# EAGLE design TutorialPCB (EAGLE 8.7.0)
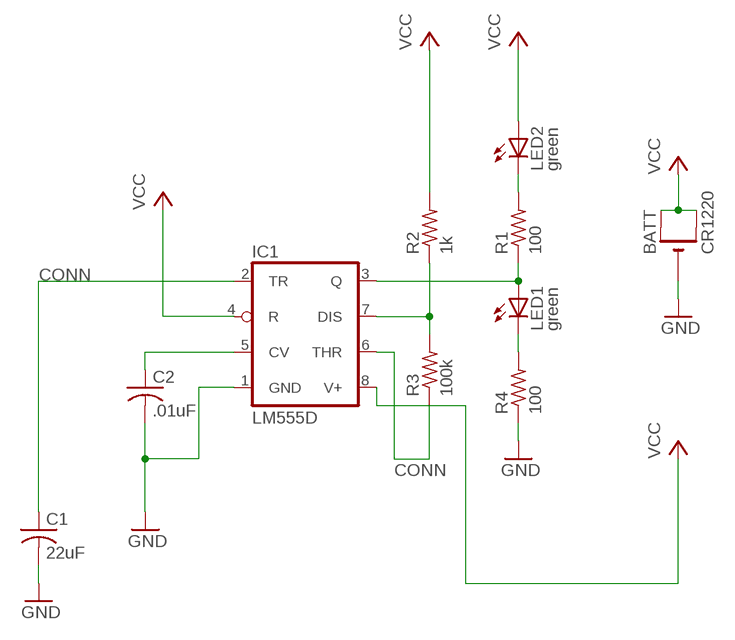
[diagram p0: schematic, sheet 1]

## Parts
BATT  CR1220  CR1220SMT  [CR1220-SMD]
C1  22uF  C-USC0805  [C0805]
C2  .01uF  C-USC0805  [C0805]
IC1  LM555D  [SO08]
LED1  green  LEDCHIPLED_0805  [CHIPLED_0805]
LED2  green  LEDCHIPLED_0805  [CHIPLED_0805]
R1  100  R-US_R0805  [R0805]
R2  1k  R-US_R0805  [R0805]
R3  100k  R-US_R0805  [R0805]
R4  100  R-US_R0805  [R0805]

## Nets
CONN: C1.1 IC1.2(TR) IC1.6(THR) R3.1
GND: BATT.- C1.2 C2.2 IC1.1(GND) R4.1
N$1: LED1.C R4.2
N$2: IC1.3(Q) LED1.A R1.1
N$3: LED2.C R1.2
N$4: IC1.7(DIS) R2.1 R3.2
N$9: C2.1 IC1.5(CV)
VCC: BATT.+$1(+) BATT.+$2(+1) IC1.4(R) IC1.8(V+) LED2.A R2.2

## Library data of the parts
BATT = adafruit:CR1220: CR1216/CR1220/CR1225 12mm 3V lithium coin cell Great for battery packup. Both SMT and THM holders. Note the THM package has the ground pads on both sides of the PCB so that the masks are the same - this reduces the cost
C1 C2 = adafruit:C-US: CAPACITOR, American symbol
IC1 = adafruit:*555: TIMER Changed DIP package to have round (not oval) pin pads http://www.ladyada.net/library/pcb/eaglelibrary.html
LED1 LED2 = adafruit:LED: LED OSRAM: - CHIPLED LG R971, LG N971, LY N971, LG Q971, LY Q971, LO R971, LY R971 LH N974, LH R974 LS Q976, LO Q976, LY Q976 LO Q996 - Hyper CHIPLED LW Q18S LB Q993, LB Q99A, LB R99A - SideLED LS A670, LO A670, LY A670, LG A670, LP A670 LB A673, LV A673, LT A673, LW A673 LH A674 LY A675 LS A676, LA A676, LO A676, LY A676, LW A676 LS A679, LY A679, LG A679 - Hyper Micro SIDELED® LS Y876, LA Y876, LO Y876, LY Y876 LT Y87S - SmartLED LW L88C, LW L88S LB L89C, LB L89S, LG L890 LS L89K, LO L89K, LY L89K LS L896, LA L896, LO L896, LY L896 - TOPLED LS T670, LO T670, LY T670, LG T670, LP T670 LSG T670, LSP T670, LSY T670, LOP T670, LYG T670 LG T671, LOG T671, LSG T671 LB T673, LV T673, LT T673, LW T673 LH T674 LS T676, LA T676, LO T676, LY T676, LB T676, LH T676, LSB T676, LW T676 LB T67C, LV T67C, LT T67C, LS T67K, LO T67K, LY T67K, LW E67C LS E67B, LA E67B, LO E67B, LY E67B, LB E67C, LV E67C, LT E67C LW T67C LS T679, LY T679, LG T679 LS T770, LO T770, LY T770, LG T770, LP T770 LB T773, LV T773, LT T773, LW T773 LH T774 LS E675, LA E675, LY E675, LS T675 LS T776, LA T776, LO T776, LY T776, LB T776 LHGB T686 LT T68C, LB T68C - Hyper Mini TOPLED® LB M676 - Mini TOPLED Santana® LG M470 LS M47K, LO M47K, LY M47K Source: http://www.osram.convergy.de/
R1-R4 = adafruit:R-US_: RESISTOR, American symbol

## Net classes
0 default: width 0.305 mm, drill 0.508 mm, clearance 0.254 mm

## Board
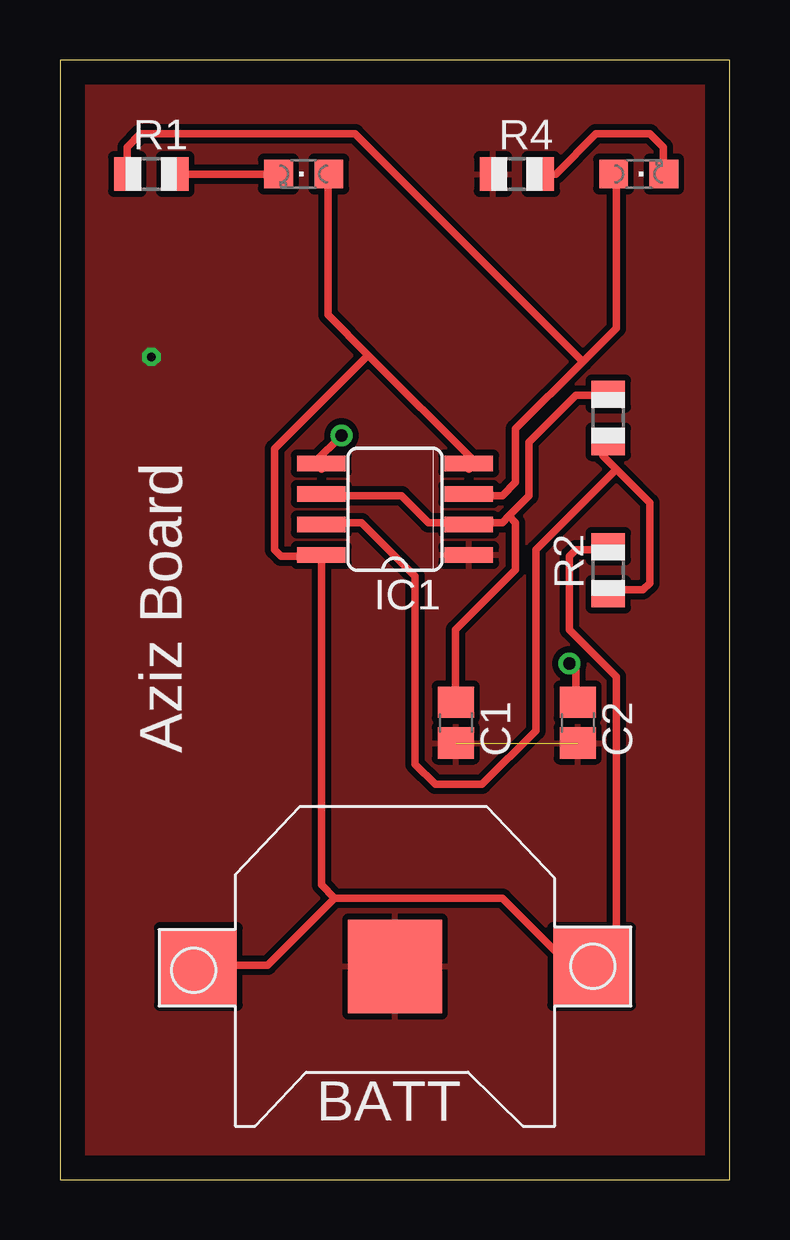
[diagram p1: board, top side]
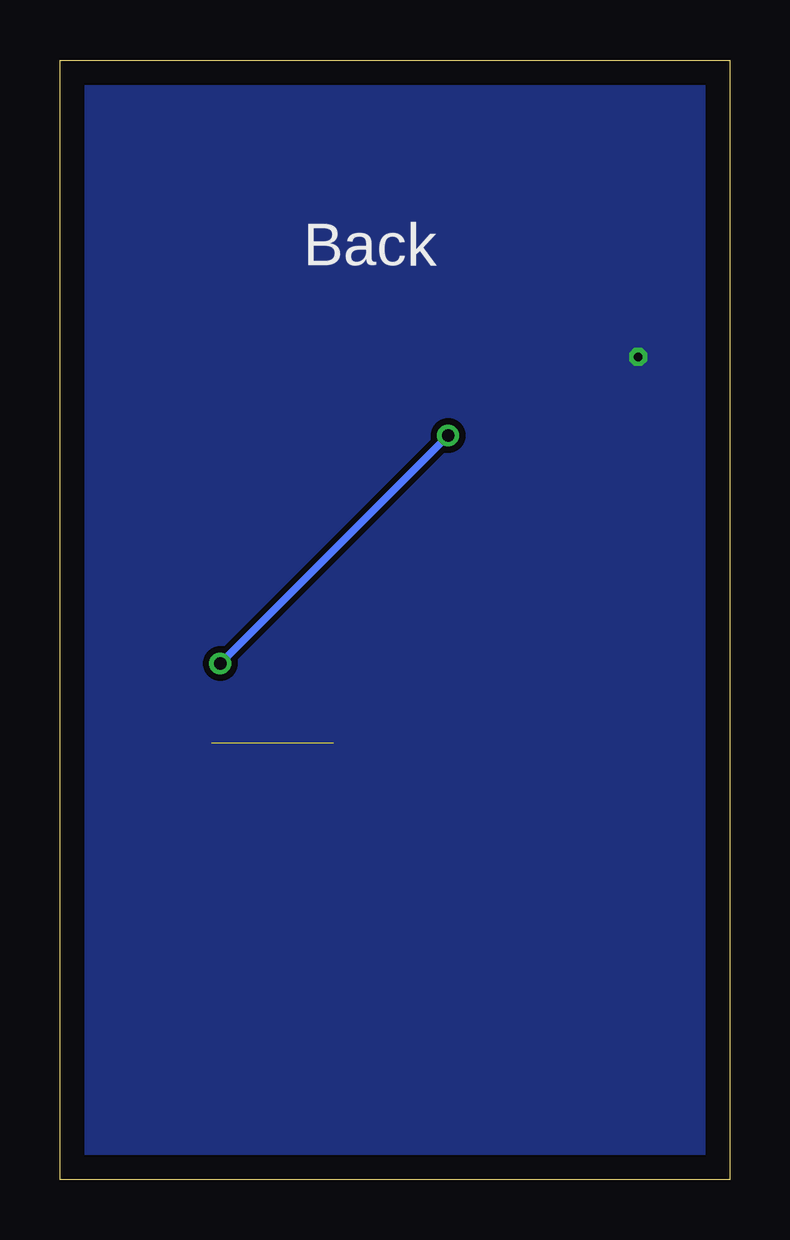
[diagram p2: board, bottom side, seen from below]

Size 27.92 x 46.66 mm. Coordinates in mm from the lower left corner, seen from the top.
Outline: 0,0 27.92,0 27.92,46.66 0,46.66 0,0
Copper layers (1*16): Top 0.035mm / dielectric 1.5mm / Bottom 0.035mm
Design rules "default": minimum track width 6mil, minimum drill 0.35mm, track to track 6mil, track to pad 6mil, pad to pad 6mil, via to via 6mil, smd to smd 6mil, copper to edge 40mil, drill to drill 6mil, minimum pad ring 10mil, minimum via ring 8mil, stop-mask expansion 4mil, vias tented up to drill 0mil, thermal gap 10mil

### Footprints (pad centres in the part's own frame; a part is rotated, then mirrored left to right if it is on the bottom)
CR1220-SMD = smd 3.2 x 3.2: +$1 -8.2,0; +$2 8.2,0 | smd 3.9 x 3.9: - 0,0
C0805 = smd 1.3 x 1.5: 1 -0.85,0; 2 0.85,0
SO08 = smd 0.66 x 2.032: 1 -1.905,-3.073; 2 -0.635,-3.073; 3 0.635,-3.073; 4 1.905,-3.073; 5 1.905,3.073; 6 0.635,3.073; 7 -0.635,3.073; 8 -1.905,3.073
CHIPLED_0805 = smd 1.2 x 1.2: A 0,-1.05; C 0,1.05
R0805 = smd 1.1 x 1.4: 1 -1,0; 2 1,0

### Placement (x,y rotation side)
BATT  13.97,8.89 180 top
C1  16.51,19.05 270 top
C2  21.59,19.05 270 top
IC1  13.97,27.94 90 top
LED1  24.13,41.91 270 top
LED2  10.16,41.91 90 top
R1  3.81,41.91 0 top
R2  22.86,25.4 90 top
R3  22.86,31.75 270 top
R4  19.05,41.91 0 top

### Tracks (layer width: path | path; a pad name or v marks a point on that pad's centre or on a via)
CONN
  Top 0.305: 18.72,27.66 18.44,27.38 17.04,27.38 | 18.72,27.66 19.56,28.5 19.56,30.73 21.51,32.69 22.63,32.69 R3.1 | 18.72,27.66 19,27.38 19,25.43 16.48,22.91 16.48,20.12 C1.1 | 17.04,27.38 15.37,27.38 14.25,28.5 10.9,28.5 IC1.6 | 17.04,27.38 IC1.2
GND  (via drill 0.35)  (1 unrouted)
  other vias: 3.81,34.29
  pour Top: -1.27,48.26 -1.27,-1.27 29.21,-1.27 29.21,48.26
  pour Bottom: -1.27,48.26 -1.27,-1.27 29.21,-1.27 29.21,48.26
N$1
  Top 0.305: R4.2 20.68,41.91 22.35,43.59 24.59,43.59 25.15,43.03 25.15,41.91 LED1.C
N$2
  Top 0.305: 21.79,34.09 19,31.29 19,29.06 18.44,28.5 17.04,28.5 IC1.3 | 21.79,34.09 23.19,35.48 23.19,41.91 LED1.A | 21.79,34.09 12.29,43.59 3.35,43.59 2.79,43.03 2.79,41.91 R1.1
N$3
  Top 0.305: R1.2 LED2.C
N$4
  Top 0.305: 23.19,29.62 22.63,30.18 22.63,30.73 R3.2 | 23.19,29.62 24.59,28.22 24.59,24.87 24.31,24.59 22.91,24.59 R2.1 | 23.19,29.62 19.84,26.26 19.84,18.72 17.6,16.48 15.65,16.48 14.81,17.32 14.81,25.15 12.57,27.38 10.9,27.38 IC1.7
N$9  (via drill 0.51)
  Top 0.305: v21.23,21.51 21.51,21.23 21.51,20.12 C2.1 | v11.73,31.01 10.62,29.9 10.9,29.62 IC1.5
  Bottom 0.305: v11.73,31.01 v21.23,21.51
VCC
  Top 0.305: 12.85,34.37 17.32,29.9 17.04,29.62 IC1.4 | 12.85,34.37 11.18,36.04 11.18,41.91 LED2.A | 10.9,25.98 9.22,25.98 8.94,26.26 8.94,30.45 12.85,34.37 | R2.2 22.63,26.26 21.51,26.26 21.23,25.98 21.23,22.91 23.19,20.95 23.19,9.78 22.35,8.94 BATT.+$1 22.07,8.94 21.23,8.94 18.44,11.73 11.46,11.73 | 11.46,11.73 8.66,8.94 5.87,8.94 BATT.+$2 | 10.9,25.98 10.9,12.29 11.46,11.73 | 10.9,25.98 IC1.8

### Text on the board
tPlace: Aziz Board
bPlace: Back